# Altium schematic sheet UsbUART.SchDoc
size A
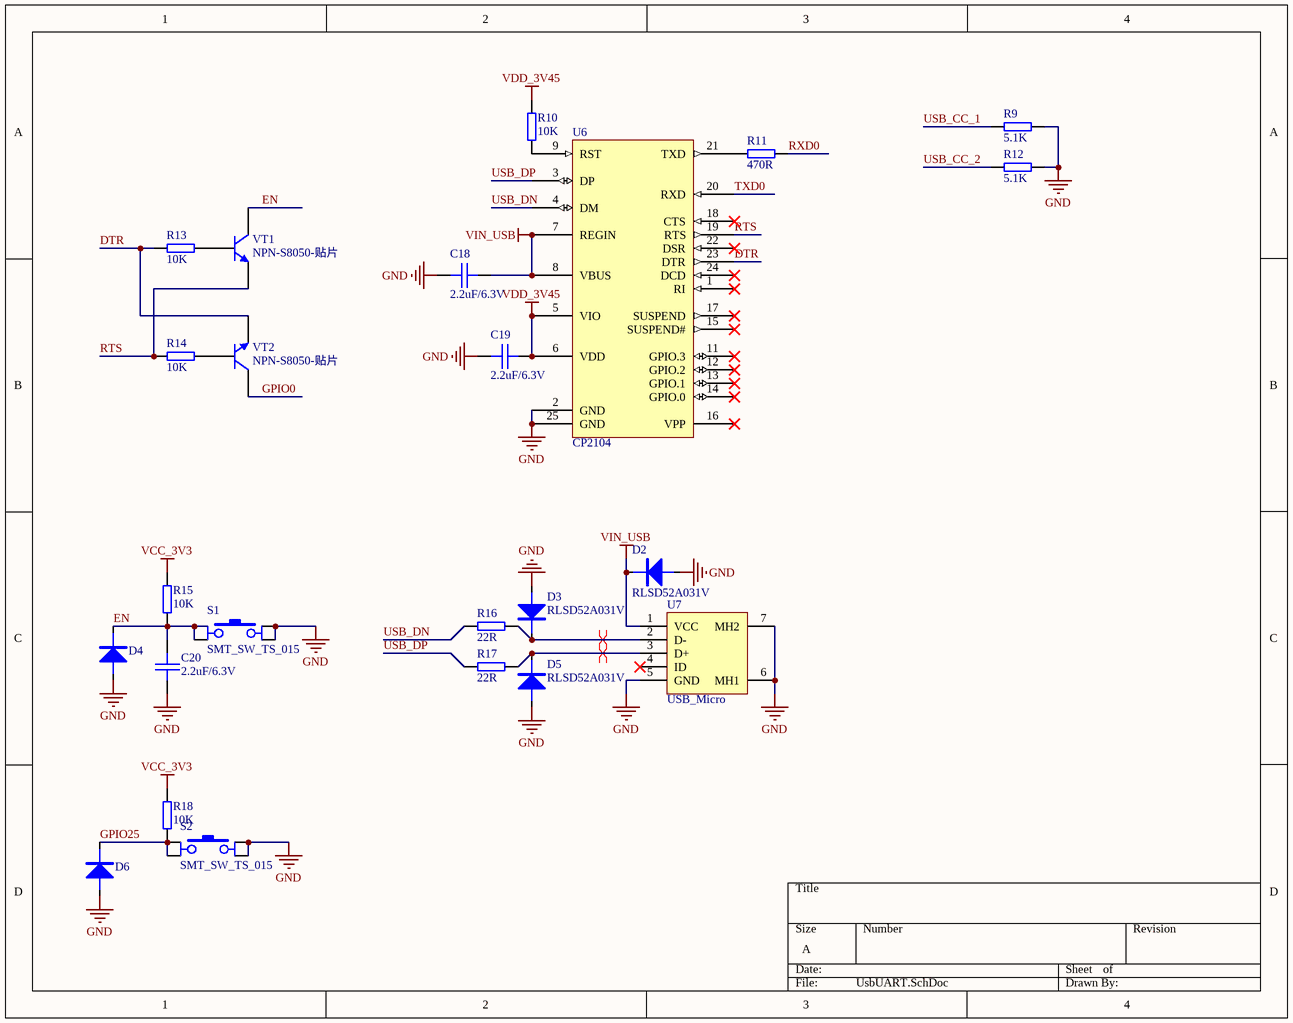
[diagram p0: UsbUART.SchDoc]

## Parts
C18  2.2uF/6.3V  [SMT_C_0402]
C19  2.2uF/6.3V  [SMT_C_0402]
C20  2.2uF/6.3V  [SMT_C_0402]
D2  RLSD52A031V  [SMT_DIODE_SOD_523]
D3  RLSD52A031V  [SMT_DIODE_SOD_523]
D4  RLSD52A031V  [SMT_DIODE_SOD_523]  (value not drawn)
D5  RLSD52A031V  [SMT_DIODE_SOD_523]
D6  RLSD52A031V  [SMT_DIODE_SOD_523]  (value not drawn)
R9  5.1K  [SMT_R_0402]
R10  10K  [SMT_R_0402]
R11  470R  [SMT_R_0402]
R12  5.1K  [SMT_R_0402]
R13  10K  [SMT_R_0402]
R14  10K  [SMT_R_0402]
R15  10K  [SMT_R_0402]
R16  22R  [SMT_R_0402]
R17  22R  [SMT_R_0402]
R18  10K  [SMT_R_0402]
S1  SMT_SW_TS_015  [SMT_SW_TS_015]
S2  SMT_SW_TS_015  [SMT_SW_TS_015]
U6  CP2104  [PQFN50P400X400X80_HS-25N]
U7  USB_Micro  [M5-USB-TC-2]
VT1  NPN-S8050-贴片  [NPN-S8050-贴片]
VT2  NPN-S8050-贴片  [NPN-S8050-贴片]

## Nets
GND: C18.1 C19.1 C20.1 D2.1(A) D3.1(A) D4.1(A) D5.1(A) D6.1(A) R9.1 R12.1 S1.3(PINB1) S1.4(PINB2) S2.3(PINB1) S2.4(PINB2) U6.2(GND) U6.25(GND) U7.5(GND) U7.6(MH1) U7.7(MH2)
VCC_3V3: R15.2 R18.2
VDD_3V45: C19.2 R10.1 U6.5(VIO) U6.6(VDD)
VIN_USB: C18.2 D2.2(K) U6.7(REGIN) U6.8(VBUS) U7.1(VCC)
DTR: R13.2 U6.23(DTR) VT2.2(E)
EN: C20.2 D4.2(K) R15.1 S1.1(PINA1) S1.2(PINA2) VT1.3(C)
GPIO0: VT2.3(C)
GPIO25: D6.2(K) R18.1 S2.1(PINA1) S2.2(PINA2)
RTS: R14.2 U6.19(RTS) VT1.2(E)
RXD0: R11.1
TXD0: U6.20(RXD)
USB_CC_1: R9.2
USB_CC_2: R12.2
USB_DN: R16.2 U6.4(DM)
USB_DP: R17.2 U6.3(DP)
NetD3_2: D3.2(K) R16.1 U7.2(D-)
NetD5_2: D5.2(K) R17.1 U7.3(D+)
NetR10_2: R10.2 U6.9(RST)
NetR11_2: R11.2 U6.21(TXD)
NetR13_1: R13.1 VT1.1(B)
NetR14_1: R14.1 VT2.1(B)

Not connected (* = marked no-connect by the designer): U6 1(RI)* 11(GPIO.3)* 12(GPIO.2)* 13(GPIO.1)* 14(GPIO.0)* 15(SUSPEND#)* 16(VPP)* 17(SUSPEND)* 18(CTS)* 22(DSR)* 24(DCD)*; U7 4(ID)*

## Layout directives
differential pair: NetD3_2, NetD5_2

## Notes on the sheet
- Labels drawn without touching a wire or pin: DSR, DTR, GND

## Library data of the parts
C18-C20 = SMT_C_0402: Surface mount capacitor 0402
D2-D6 = SMT_DIODE_SOD_323: Surface mount diode SOD-323(0805) Package
R9-R15 R18 = SMT_R_0402: Surface mount resistor 0402
R16 R17 = SMT_R_0603: Surface mount resistor 0603
U6 = CP2104: 单芯片USB转UART桥接器
U7 = USB_Micro: USB micro female